# Altium schematic sheet adc_dac_lo6.SchDoc: mcHF QRP Transceiver RF board
size A4; Author: K Atanassov; CompanyName: M0NKA; Revision: 0.6.3; SheetTotal: 12
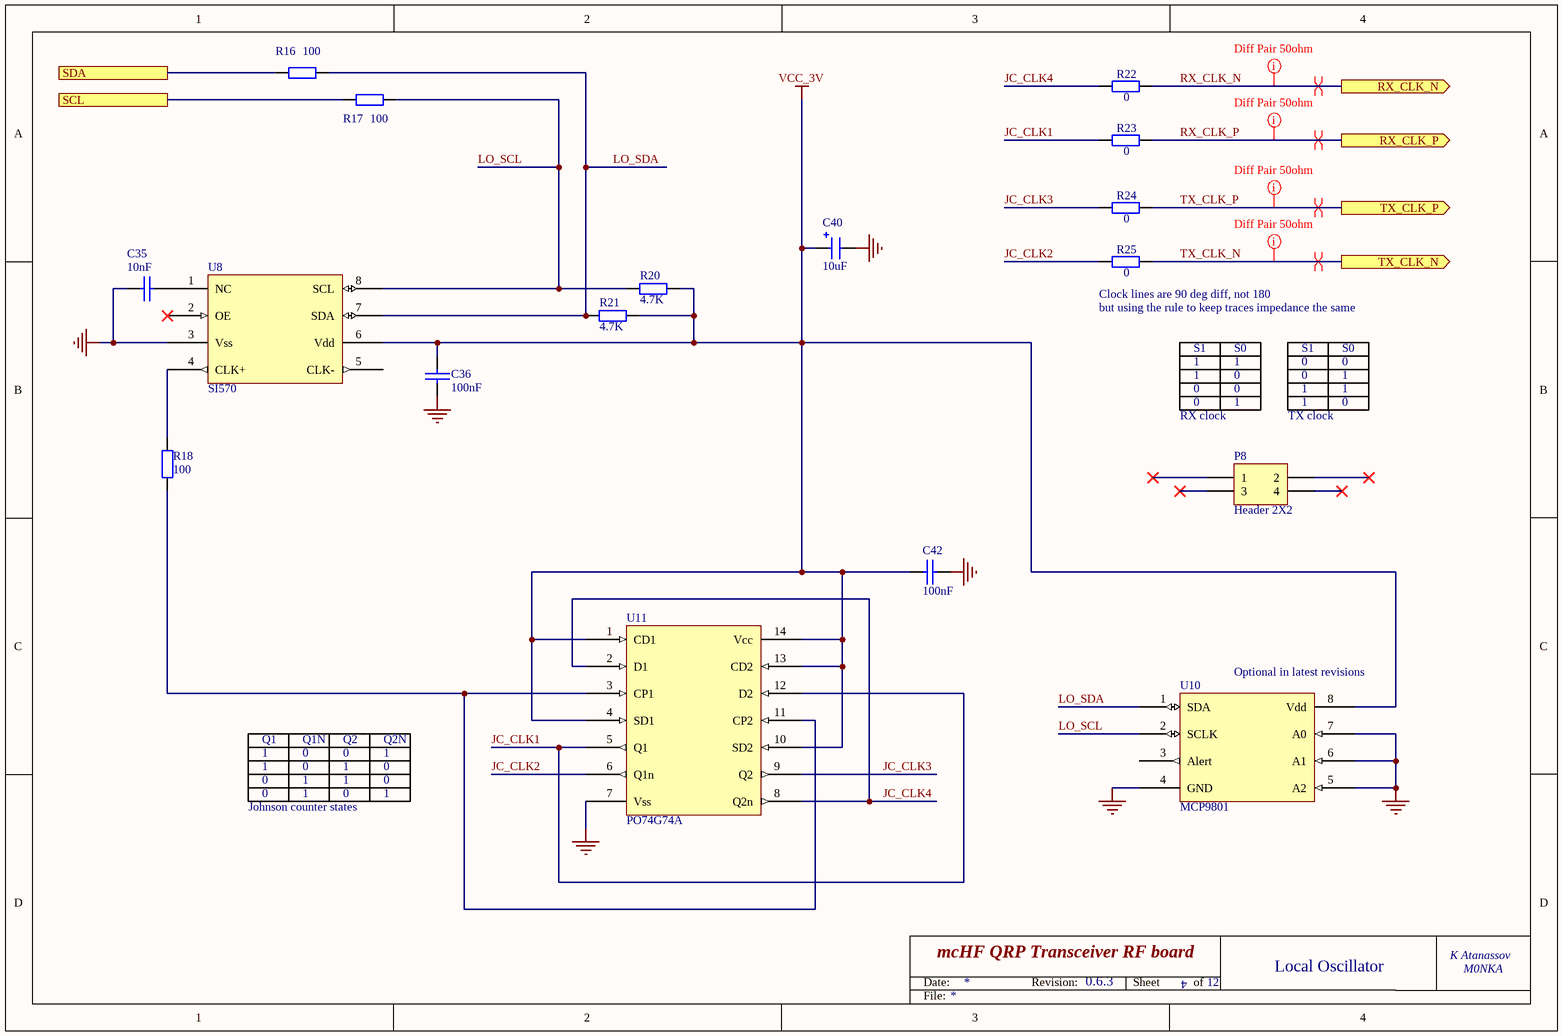
[diagram p0: adc_dac_lo6.SchDoc]

## Parts
C35  10nF  [0805-Pro]
C36  100nF  [0805-Pro]
C40  10uF  [1206_Elec_Cap_N]
C42  100nF  [0805-Pro]
P8  Header 2X2  [HDR2X2]
R16  100  [0805-Pro]
R17  100  [0805-Pro]
R18  100  [0805-Pro]
R20  4.7K  [0805-Pro]
R21  4.7K  [0805-Pro]
R22  0  [0805-Pro]
R23  0  [0805-Pro]
R24  0  [0805-Pro]
R25  0  [0805-Pro]
U8  SI570  [SI570_m]
U10  MCP9801  [SO-8]  (no BOM)
U11  PO74G74A  [SO-14-Pro]

## Ports
RX_CLK_N (out), RX_CLK_P (out), SCL, SDA, TX_CLK_N (out), TX_CLK_P (out)

## Nets
GND: C35.1 C36.2 C40.2 C42.1 U8.3(Vss) U10.4(GND) U10.5(A2) U10.6(A1) U10.7(A0) U11.7(Vss)
VCC_3V: C36.1 C40.1 C42.2 R20.2 R21.2 U8.6(Vdd) U10.8(Vdd) U11.1(CD1) U11.4(SD1) U11.10(SD2) U11.13(CD2) U11.14(Vcc)
JC_CLK1: R23.2 U11.5(Q1) U11.12(D2)
JC_CLK2: R25.2 U11.6(Q1n)
JC_CLK3: R24.2 U11.9(Q2)
JC_CLK4: R22.2 U11.2(D1) U11.8(Q2n)
LO_SCL: R17.1 R20.1 U8.8(SCL) U10.2(SCLK)
LO_SDA: R16.1 R21.1 U8.7(SDA) U10.1(SDA)
RX_CLK_N: R22.1 ; port RX_CLK_N
RX_CLK_P: R23.1 ; port RX_CLK_P
SCL: R17.2 ; port SCL
SDA: R16.2 ; port SDA
TX_CLK_N: R25.1 ; port TX_CLK_N
TX_CLK_P: R24.1 ; port TX_CLK_P
NetC35_2: C35.2 U8.1(NC)
NetR18_1: R18.1 U11.3(CP1) U11.11(CP2)
NetR18_2: R18.2 U8.4(CLK+)

Not connected (* = marked no-connect by the designer): P8 1* 2* 3* 4*; U8 2(OE)* 5(CLK-); U10 3(Alert)

## Layout directives
differential pair: RX_CLK_N, RX_CLK_P, TX_CLK_N, TX_CLK_P
rule Matched Net Lengths [Tolerance = 150mil]: RX_CLK_N, RX_CLK_P, TX_CLK_N, TX_CLK_P

## Notes on the sheet
- (near R25) Clock lines are 90 deg diff, not 180
- (near R25) but using the rule to keep traces impedance the same
- S1
- 1
- S0
- 0
- RX clock
- TX clock
- (near U10) Optional in latest revisions
- Q1
- Q1N
- Q2
- Q2N
- Johnson counter states
- 4
- Local Oscillator
- Date:
- Revision:
- Sheet
- of
- File:

## Library data of the parts
C35 = CAP: Capacitor; Order: FN 233-2713; QT Order: QCC-00097; Price: 0.059
C36 C42 = CAP: Capacitor; Order: FN 252-2090; QT Order: QCC-00154; Price: 0.068
C40 = CAP-POL: Electrolitic capacitor; Order: FN 233-3009; QT Order: QCC-00166; Price: 0.204
P8 = Header 2X2: Header, 2-Pin, Dual row; LatestRevisionDate: 17-Jul-2002; LatestRevisionNote: Re-released for DXP Platform.; Publisher: Altium Limited
R16-R18 = RES: Resistor; Order: FN 933-2375; QT Order: QCR-00301; Price: 0.027
R20 R21 = RES: Resistor; Order: FN 200-8383; QT Order: QCR-00341; Price: 0.024
R22-R25 = RES: Resistor; Order: FN 933-3681; QT Order: QCR-00268; Price: 0.009
U8 = SI570: I2C programmable XO; Order: DK 336-2518-ND; Price: 8.72
U10 = MCP9801: 2-Wire High-Accuracy Temperature Sensor; Order: FN 143-9486; Price: 1.05
U11 = 74LCX74M: Low Voltage Dual D-Type Positive Edge-Triggered  Flip-Flop with 5V Tolerant Inputs; Order: FN 985-3502; Price: 0.23